# EAGLE design 01-main (EAGLE 9.6.2)

## Sheet 1 of 3
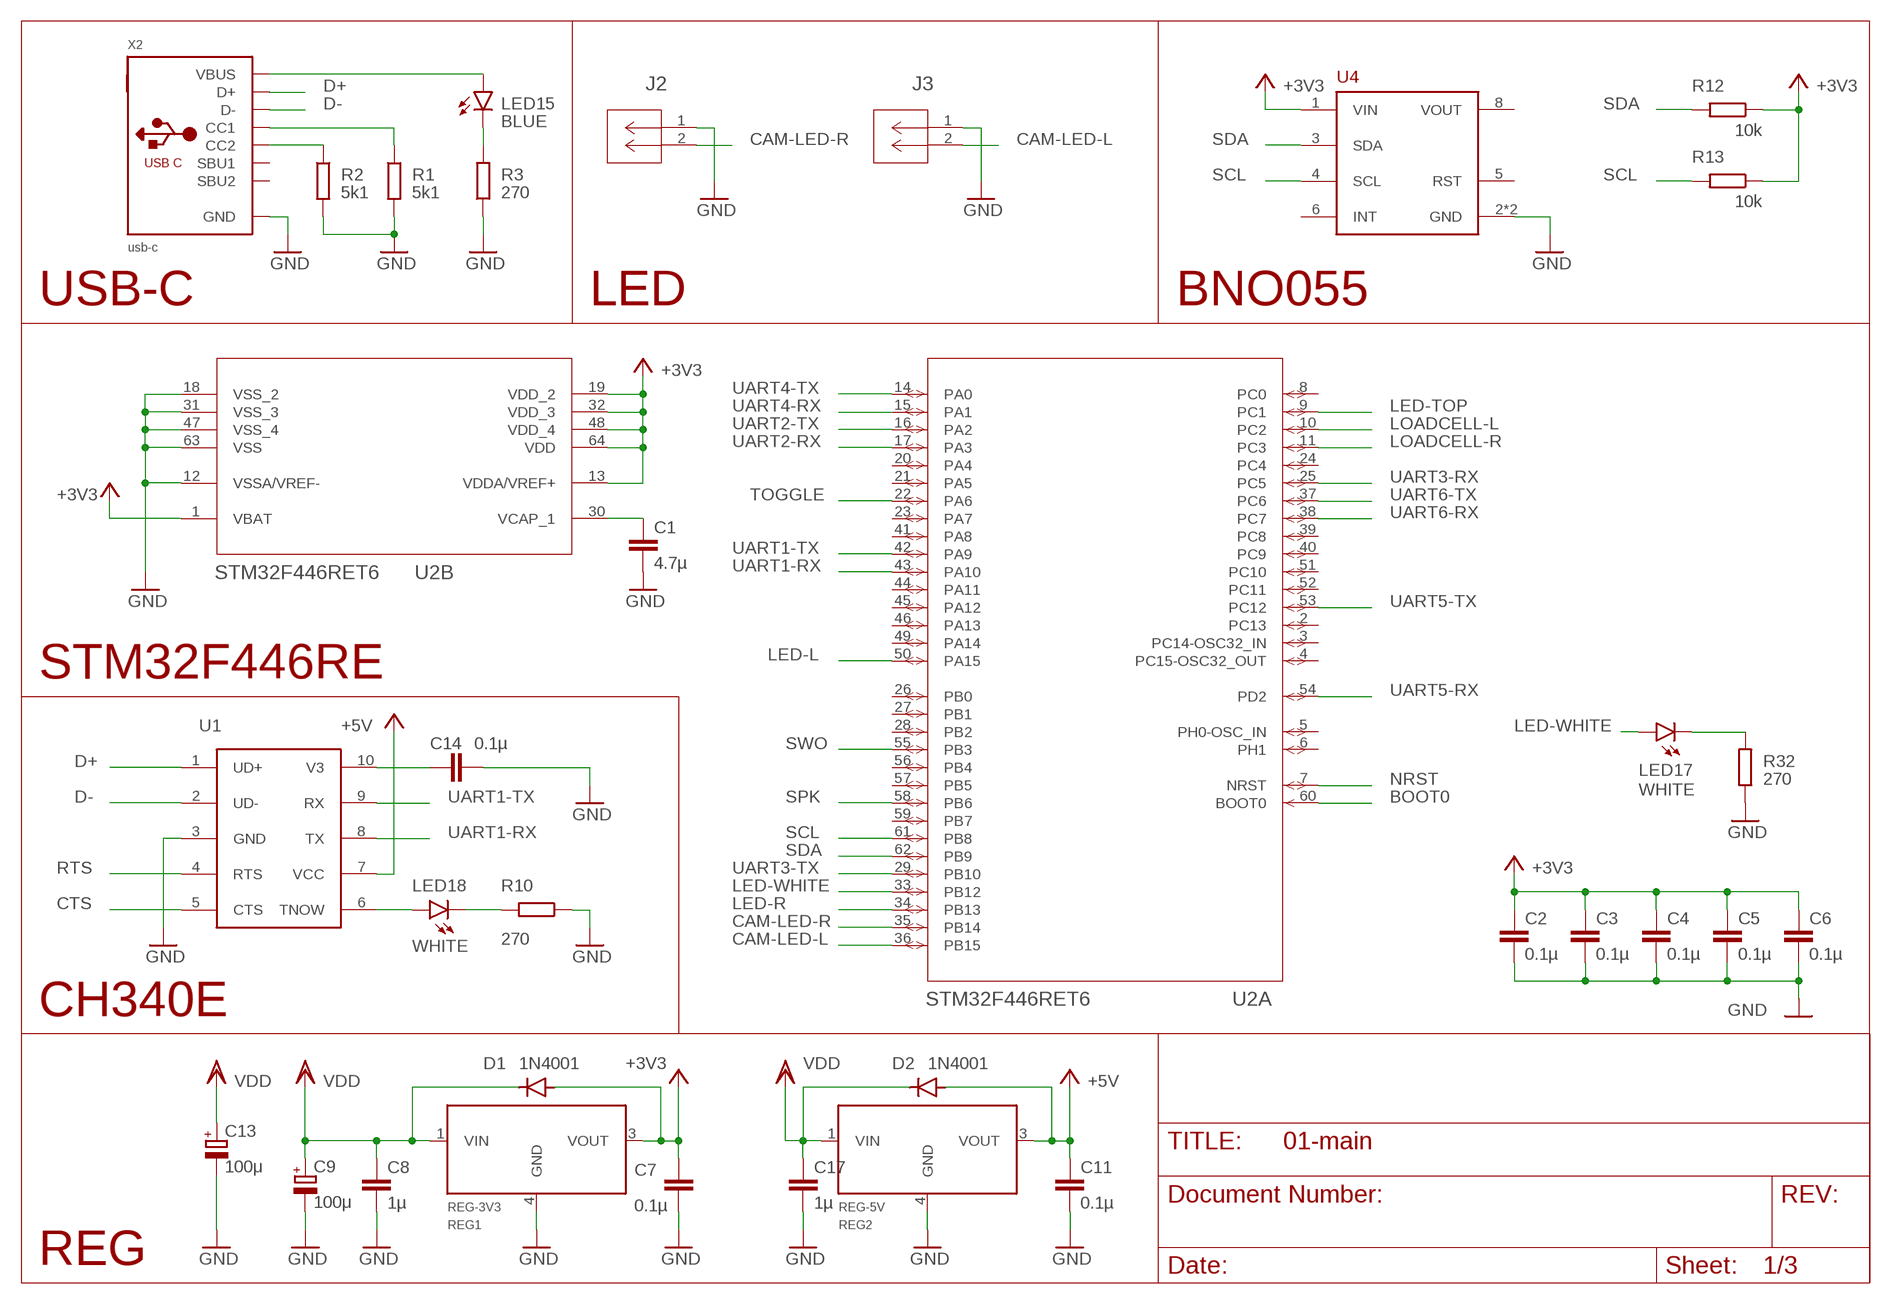
[diagram p0: schematic, sheet 1]

### Parts
C1  4.7µ  C-EUC0603  [C0603]
C2  0.1µ  C-EUC0603  [C0603]
C3  0.1µ  C-EUC0603  [C0603]
C4  0.1µ  C-EUC0603  [C0603]
C5  0.1µ  C-EUC0603  [C0603]
C6  0.1µ  C-EUC0603  [C0603]
C7  0.1µ  C-EUC0603  [C0603]
C8  1µ  C-EUC0603  [C0603]
C9  100μ  CPOL-EU153CLV-0505  [153CLV-0505]
C11  0.1µ  C-EUC0603  [C0603]
C13  100μ  CPOL-EU153CLV-0505  [153CLV-0505]
C14  0.1µ  C-EUC0603  [C0603]
C17  1µ  C-EUC0603  [C0603]
D1  1N4001  GF1  [SMA-DO214AC]
D2  1N4001  GF1  [SMA-DO214AC]
J2  22057025  [CON_22057025_MOL]
J3  22057025  [CON_22057025_MOL]
LED15  BLUE  LEDSML0603  [SML0603]
LED17  WHITE  LEDSML0603  [SML0603]
LED18  WHITE  LEDSML0603  [SML0603]
R1  5k1  R-EU_R0402  [R0402]
R2  5k1  R-EU_R0402  [R0402]
R3  270  R-EU_R0402  [R0402]
R10  270  R-EU_R0402  [R0402]
R12  10k  R-EU_R0402  [R0402]
R13  10k  R-EU_R0402  [R0402]
R32  270  R-EU_R0402  [R0402]
REG1  REG-3V3  MYPARTS_NJM7800S-REGULATOR  [MYPARTS_D-PAK_TO252AA]
REG2  REG-5V  MYPARTS_NJM7800S-REGULATOR  [MYPARTS_D-PAK_TO252AA]
U1  CH340ESMD  [MSOP10]
U2  STM32F446RET6  [LQFP64-10X10MM]
U4  BNO055  [SOCKET-08]
X2  usb-c  USB_C  [USB_C_CUSB31-CFM2AX-01-X]

### Nets
+3V3: C2.1 C3.1 C4.1 C5.1 C6.1 C7.1 D1.A R12.1 R13.1 REG1.3(VOUT) U2.1(B:VBAT) U2.13(B:VDDA/VREF+) U2.19(B:VDD_2) U2.32(B:VDD_3) U2.48(B:VDD_4) U2.64(B:VDD) U4.1(VIN) ; also sheet 3
+5V: C11.1 D2.A REG2.3(VOUT) U1.7(VCC) ; also sheet 2,3
BOOT0: U2.60(A:BOOT0) ; also sheet 3
CAM-LED-L: J3.2 U2.36(A:PB15)
CAM-LED-R: J2.2 U2.35(A:PB14)
CTS: U1.5(CTS)
D+: U1.1(UD+) X2.A6(D+) X2.B6(D+)
D-: U1.2(UD-) X2.A7(D-) X2.B7(D-)
GND: C1.2 C2.2 C3.2 C4.2 C5.2 C6.2 C7.2 C8.2 C9.- C11.2 C13.- C14.2 C17.2 J2.1 J3.1 R1.2 R2.2 R3.1 R10.1 R32.1 REG1.4(GND) REG2.4(GND) U1.3(GND) U2.12(B:VSSA/VREF-) U2.18(B:VSS_2) U2.31(B:VSS_3) U2.47(B:VSS_4) U2.63(B:VSS) U4.2(GND) U4.7(GND) X2.A1B12(GND) X2.B1A12(GND) ; also sheet 2,3
LED-L: U2.50(A:PA15) ; also sheet 2
LED-R: U2.34(A:PB13) ; also sheet 2
LED-TOP: U2.9(A:PC1) ; also sheet 2
LED-WHITE: LED17.A U2.33(A:PB12)
LOADCELL-L: U2.10(A:PC2) ; also sheet 3
LOADCELL-R: U2.11(A:PC3) ; also sheet 3
N$8: C14.1 U1.10(V3)
N$14: R1.1 X2.A5(CC1)
N$15: R2.1 X2.B5(CC2)
N$16: LED15.C R3.2
N$18: C1.1 U2.30(B:VCAP_1)
N$19: LED18.A U1.6(TNOW)
N$20: LED18.C R10.2
N$32: LED17.C R32.2
N$49: LED15.A X2.A4B9(VBUS) X2.B4A9(VBUS)
NRST: U2.7(A:NRST) ; also sheet 3
RTS: U1.4(RTS)
SCL: R13.2 U2.61(A:PB8) U4.4(SCL)
SDA: R12.2 U2.62(A:PB9) U4.3(SDA)
SPK: U2.58(A:PB6) ; also sheet 3
SWO: U2.55(A:PB3)
TOGGLE: U2.22(A:PA6) ; also sheet 3
UART1-RX: U1.8(TX) U2.43(A:PA10)
UART1-TX: U1.9(RX) U2.42(A:PA9) ; also sheet 3
UART2-RX: U2.17(A:PA3) ; also sheet 2
UART2-TX: U2.16(A:PA2) ; also sheet 2
UART3-RX: U2.25(A:PC5) ; also sheet 3
UART3-TX: U2.29(A:PB10) ; also sheet 3
UART4-RX: U2.15(A:PA1) ; also sheet 2
UART4-TX: U2.14(A:PA0) ; also sheet 2
UART5-RX: U2.54(A:PD2) ; also sheet 2
UART5-TX: U2.53(A:PC12) ; also sheet 2
UART6-RX: U2.38(A:PC7) ; also sheet 2
UART6-TX: U2.37(A:PC6) ; also sheet 2
VDD: C8.1 C9.+ C13.+ C17.1 D1.K(C) D2.K(C) REG1.1(VIN) REG2.1(VIN) ; also sheet 2,3
Unconnected: U2.2(A:PC13) U2.3(A:PC14-OSC32_IN) U2.4(A:PC15-OSC32_OUT) U2.5(A:PH0-OSC_IN) U2.6(A:PH1) U2.8(A:PC0) U2.20(A:PA4) U2.21(A:PA5) U2.23(A:PA7) U2.24(A:PC4) U2.26(A:PB0) U2.27(A:PB1) U2.28(A:PB2) U2.39(A:PC8) U2.40(A:PC9) U2.41(A:PA8) U2.44(A:PA11) U2.45(A:PA12) U2.46(A:PA13) U2.49(A:PA14) U2.51(A:PC10) U2.52(A:PC11) U2.56(A:PB4) U2.57(A:PB5) U2.59(A:PB7) U4.5(RST) U4.6(INT) X2.A8(SBU1) X2.B8(SBU2)

### Notes on the sheet
- USB-C | LED | BNO055
- STM32F446RE
- CH340E
- REG

## Sheet 2 of 3
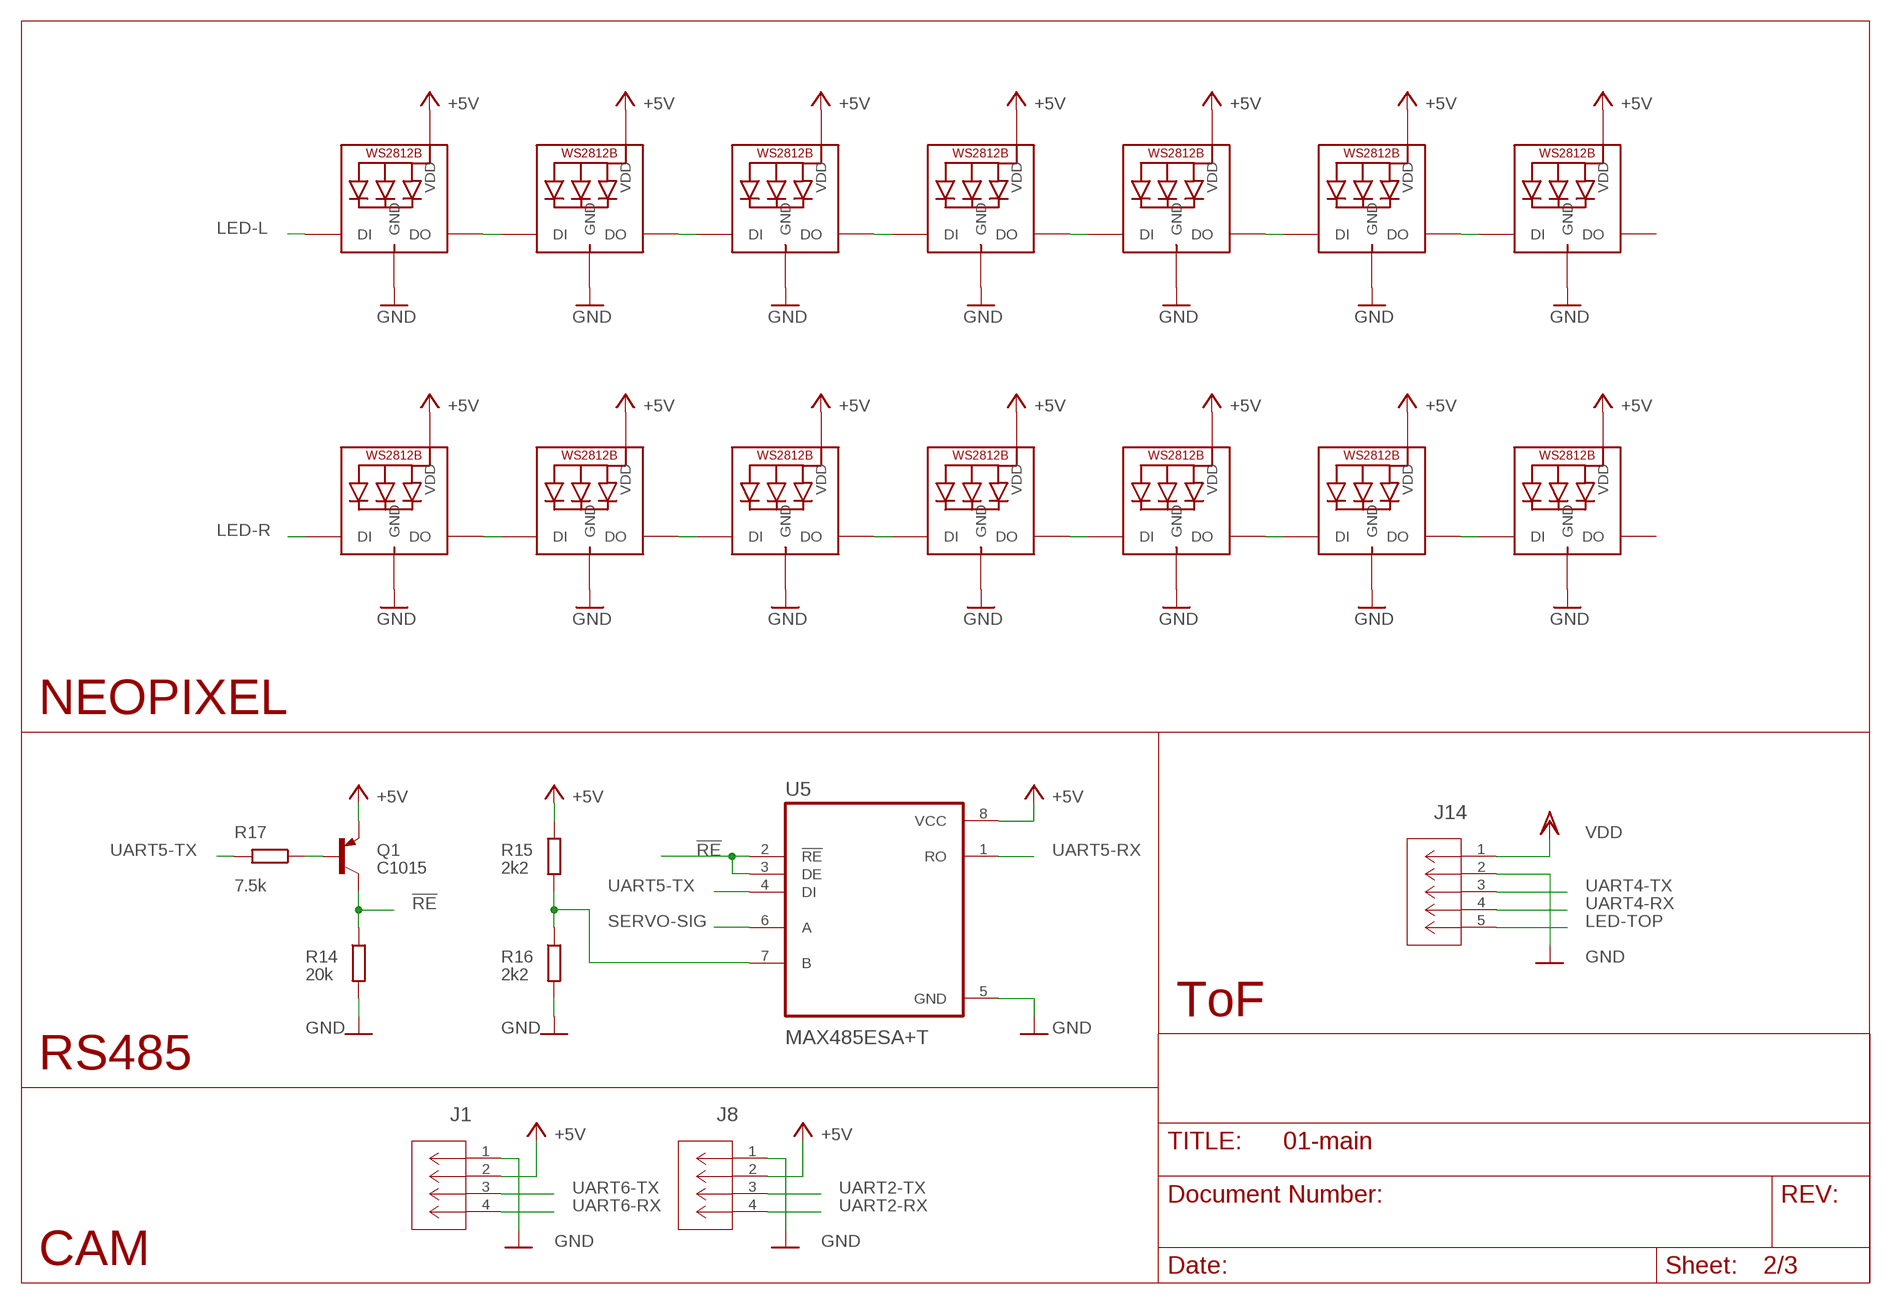
[diagram p1: schematic, sheet 2]

### Parts
J1  22057045  [CON_22057045_MOL]
J8  22057045  [CON_22057045_MOL]
J14  22057055  [CON_22057055_MOL]
LED1  WS2812B_2020  [WS2812B_2020]
LED2  WS2812B_2020  [WS2812B_2020]
LED3  WS2812B_2020  [WS2812B_2020]
LED4  WS2812B_2020  [WS2812B_2020]
LED5  WS2812B_2020  [WS2812B_2020]
LED6  WS2812B_2020  [WS2812B_2020]
LED7  WS2812B_2020  [WS2812B_2020]
LED8  WS2812B_2020  [WS2812B_2020]
LED9  WS2812B_2020  [WS2812B_2020]
LED10  WS2812B_2020  [WS2812B_2020]
LED11  WS2812B_2020  [WS2812B_2020]
LED12  WS2812B_2020  [WS2812B_2020]
LED13  WS2812B_2020  [WS2812B_2020]
LED14  WS2812B_2020  [WS2812B_2020]
Q1  C1015  BCX71SMD  [SOT23]
R14  20k  R-EU_R0402  [R0402]
R15  2k2  R-EU_R0402  [R0402]
R16  2k2  R-EU_R0402  [R0402]
R17  7.5k  R-EU_R0402  [R0402]
U5  MAX485ESA+T  [SOIC127P600X175-8N]

### Nets
!RE: Q1.3(C) R14.1 U5.2(!RE) U5.3(DE)
+5V: J1.2 J8.2 LED1.4(VDD) LED2.4(VDD) LED3.4(VDD) LED4.4(VDD) LED5.4(VDD) LED6.4(VDD) LED7.4(VDD) LED8.4(VDD) LED9.4(VDD) LED10.4(VDD) LED11.4(VDD) LED12.4(VDD) LED13.4(VDD) LED14.4(VDD) Q1.2(E) R15.1 U5.8(VCC) ; also sheet 1,3
GND: J1.1 J8.1 J14.2 LED1.2(GND) LED2.2(GND) LED3.2(GND) LED4.2(GND) LED5.2(GND) LED6.2(GND) LED7.2(GND) LED8.2(GND) LED9.2(GND) LED10.2(GND) LED11.2(GND) LED12.2(GND) LED13.2(GND) LED14.2(GND) R14.2 R16.2 U5.5(GND) ; also sheet 1,3
LED-L: LED1.3(DI) ; also sheet 1
LED-R: LED8.3(DI) ; also sheet 1
LED-TOP: J14.5 ; also sheet 1
N$1: LED1.1(DO) LED2.3(DI)
N$2: LED2.1(DO) LED3.3(DI)
N$3: LED3.1(DO) LED4.3(DI)
N$4: LED4.1(DO) LED5.3(DI)
N$5: LED5.1(DO) LED6.3(DI)
N$6: LED6.1(DO) LED7.3(DI)
N$7: LED8.1(DO) LED9.3(DI)
N$9: LED9.1(DO) LED10.3(DI)
N$10: LED10.1(DO) LED11.3(DI)
N$11: LED11.1(DO) LED12.3(DI)
N$12: LED12.1(DO) LED13.3(DI)
N$13: LED13.1(DO) LED14.3(DI)
N$27: Q1.1(B) R17.1
N$28: R15.2 R16.1 U5.7(B)
SERVO-SIG: U5.6(A) ; also sheet 3
UART2-RX: J8.4 ; also sheet 1
UART2-TX: J8.3 ; also sheet 1
UART4-RX: J14.4 ; also sheet 1
UART4-TX: J14.3 ; also sheet 1
UART5-RX: U5.1(RO) ; also sheet 1
UART5-TX: R17.2 U5.4(DI) ; also sheet 1
UART6-RX: J1.4 ; also sheet 1
UART6-TX: J1.3 ; also sheet 1
VDD: J14.1 ; also sheet 1,3
Unconnected: LED7.1(DO) LED14.1(DO)

### Notes on the sheet
- NEOPIXEL
- ToF
- RS485
- CAM

## Sheet 3 of 3
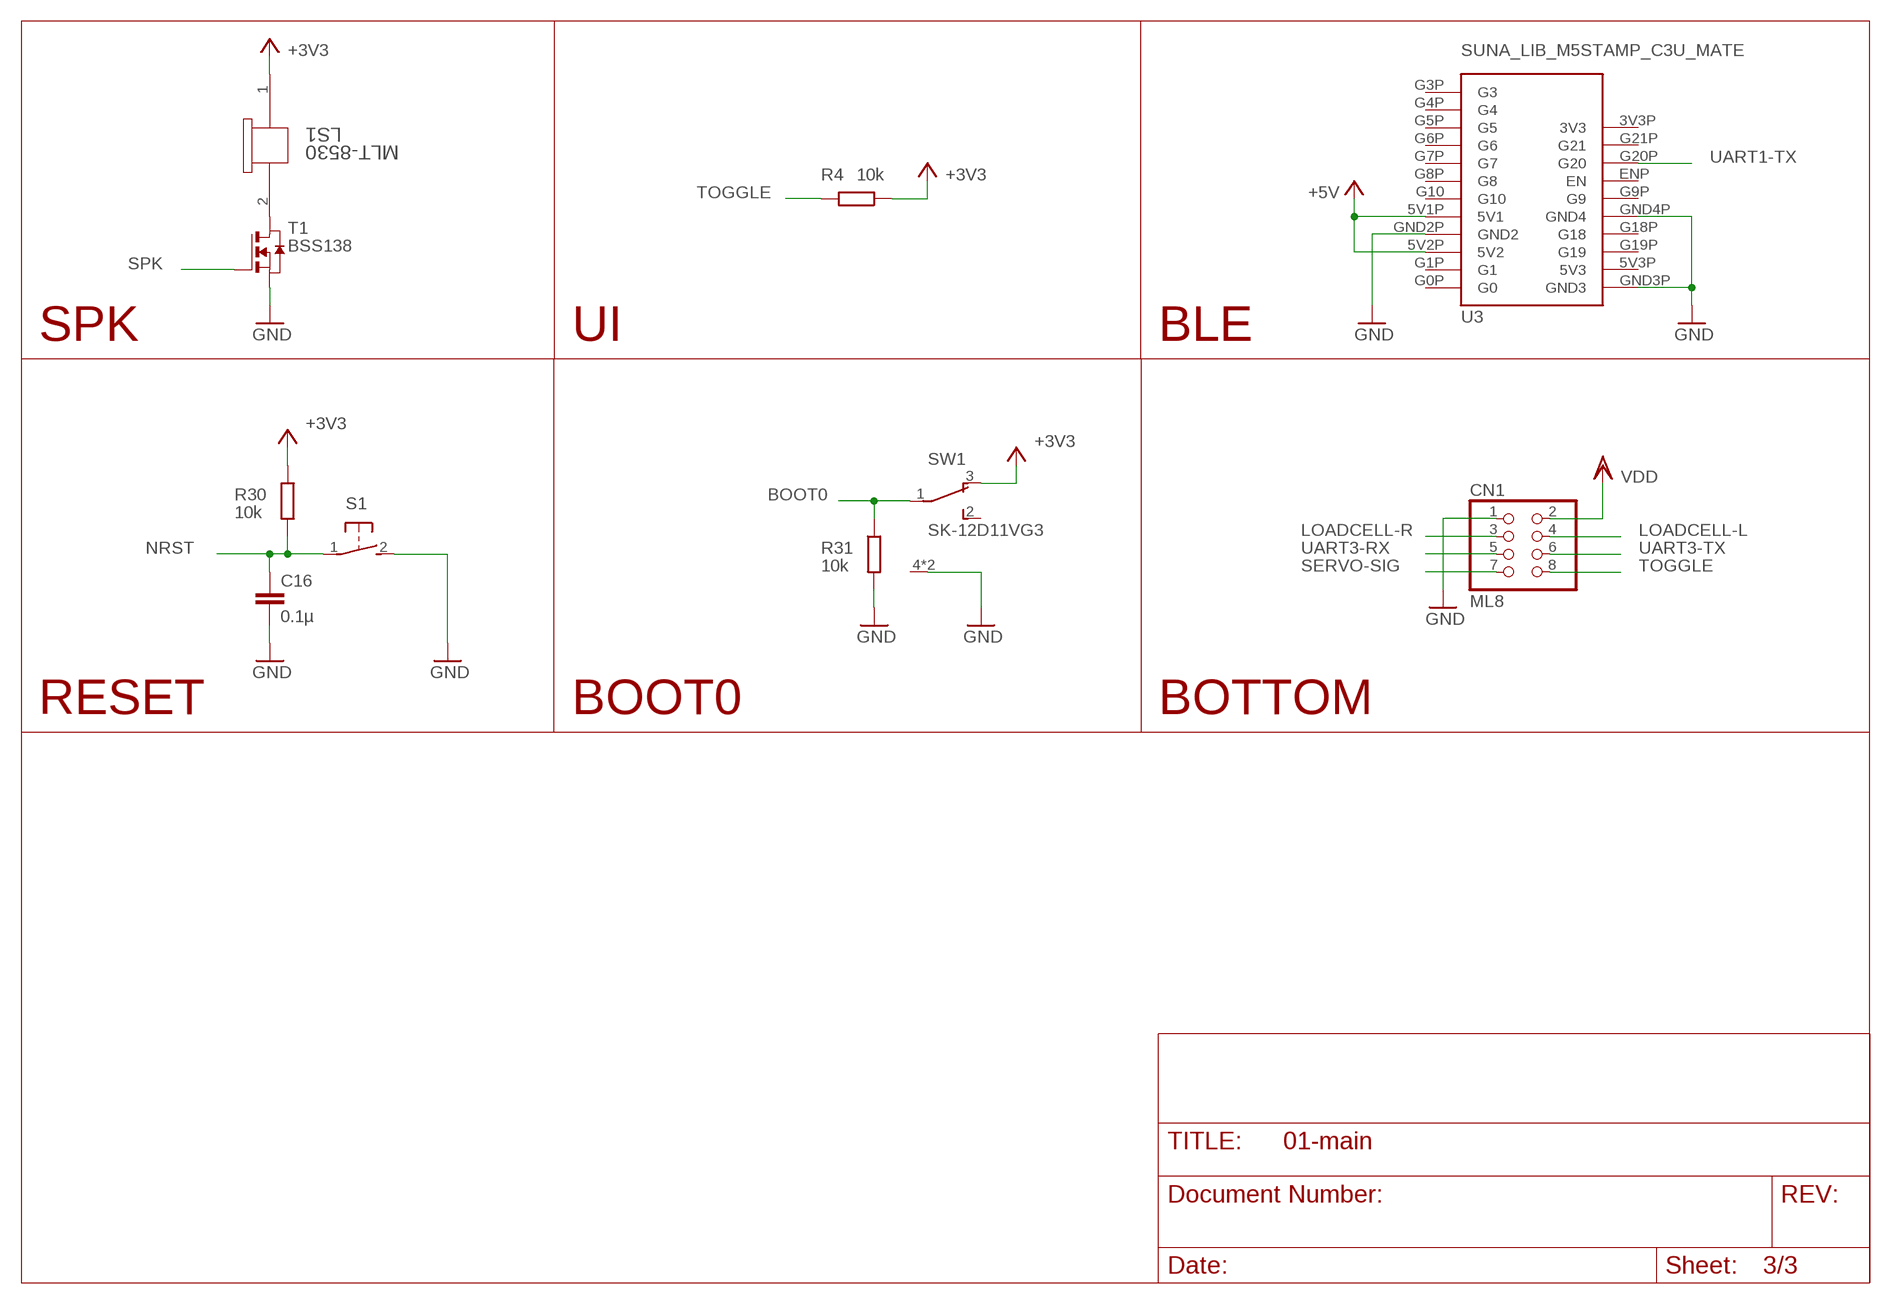
[diagram p2: schematic, sheet 3]

### Parts
C16  0.1µ  C-EUC0603  [C0603]
CN1  ML8  [ML6L]
LS1  MLT-8530  [MLT-8530_JHE]
R4  10k  R-EU_R0402  [R0402]
R30  10k  R-EU_R0402  [R0402]
R31  10k  R-EU_R0402  [R0402]
S1  31-XX  [B3F-31XX]
SW1  SK-12D11VG3  [SK-12D11VG3]
T1  BSS138  NMOSSOT23  [SOT-23]
U3  SUNA_LIB_M5STAMP_C3U_MATE  [SUNA_LIB_M5STAMPC3UMATE]

### Nets
+3V3: LS1.1 R4.1 R30.1 SW1.3(O) ; also sheet 1
+5V: U3.5V1P(5V1) U3.5V2P(5V2) ; also sheet 1,2
BOOT0: R31.1 SW1.1(P) ; also sheet 1
GND: C16.2 CN1.1 R31.2 S1.2(S) SW1.4(CASE) SW1.5(CASE) T1.2(S) U3.GND2P(GND2) U3.GND3P(GND3) U3.GND4P(GND4) ; also sheet 1,2
LOADCELL-L: CN1.4 ; also sheet 1
LOADCELL-R: CN1.3 ; also sheet 1
N$17: LS1.2 T1.1(D)
NRST: C16.1 R30.2 S1.1(P) ; also sheet 1
SERVO-SIG: CN1.7 ; also sheet 2
SPK: T1.3(G) ; also sheet 1
TOGGLE: CN1.8 R4.2 ; also sheet 1
UART1-TX: U3.G20P(G20) ; also sheet 1
UART3-RX: CN1.5 ; also sheet 1
UART3-TX: CN1.6 ; also sheet 1
VDD: CN1.2 ; also sheet 1,2
Unconnected: SW1.2(S) U3.3V3P(3V3) U3.5V3P(5V3) U3.ENP(EN) U3.G0P(G0) U3.G1P(G1) U3.G3P(G3) U3.G4P(G4) U3.G5P(G5) U3.G6P(G6) U3.G7P(G7) U3.G8P(G8) U3.G9P(G9) U3.G10 U3.G18P(G18) U3.G19P(G19) U3.G21P(G21)

### Notes on the sheet
- SPK | UI | BLE
- RESET | BOOT0 | BOTTOM

## Power pins joined to a net without a drawn wire
VOUT: U4.8(VOUT)

## Library data of the parts
C1-C8 C11 C14 C16 C17 = rcl:C-EU: CAPACITOR, European symbol; SPICEPREFIX: C
C9 C13 = rcl:CPOL-EU: POLARIZED CAPACITOR, European symbol; SPICEPREFIX: C
CN1 = ML8:ML8
D1 D2 = diode:GF1: DIODE
J1 J8 = con-molex-5268:22057045; COPYRIGHT: Copyright (C) 2022 Ultra Librarian. All rights reserved.; MANUFACTURER_PART_NUMBER: 22057045; MFR_NAME: Molex Connector Corporation
J2 J3 = con-molex-5268:22057025; COPYRIGHT: Copyright (C) 2022 Ultra Librarian. All rights reserved.; MANUFACTURER_PART_NUMBER: 22057025; MFR_NAME: Molex Connector Corporation
J14 = con-molex-5268:22057055; COPYRIGHT: Copyright (C) 2022 Ultra Librarian. All rights reserved.; MANUFACTURER_PART_NUMBER: 22057055; MFR_NAME: Molex Connector Corporation
LED1-LED14 = microbuilder:WS2812B
LED15 LED17 LED18 = led:LED: LED OSRAM: - CHIPLED LG R971, LG N971, LY N971, LG Q971, LY Q971, LO R971, LY R971 LH N974, LH R974 LS Q976, LO Q976, LY Q976 LO Q996 - Hyper CHIPLED LW Q18S LB Q993, LB Q99A, LB R99A - SideLED LS A670, LO A670, LY A670, LG A670, LP A670 LB A673, LV A673, LT A673, LW A673 LH A674 LY A675 LS A676, LA A676, LO A676, LY A676, LW A676 LS A679, LY A679, LG A679 - Hyper Micro SIDELED® LS Y876, LA Y876, LO Y876, LY Y876 LT Y87S - SmartLED LW L88C, LW L88S LB L89C, LB L89S, LG L890 LS L89K, LO L89K, LY L89K LS L896, LA L896, LO L896, LY L896 - TOPLED LS T670, LO T670, LY T670, LG T670, LP T670 LSG T670, LSP T670, LSY T670, LOP T670, LYG T670 LG T671, LOG T671, LSG T671 LB T673, LV T673, LT T673, LW T673 LH T674 LS T676, LA T676, LO T676, LY T676, LB T676, LH T676, LSB T676, LW T676 LB T67C, LV T67C, LT T67C, LS T67K, LO T67K, LY T67K, LW E67C LS E67B, LA E67B, LO E67B, LY E67B, LB E67C, LV E67C, LT E67C LW T67C LS T679, LY T679, LG T679 LS T770, LO T770, LY T770, LG T770, LP T770 LB T773, LV T773, LT T773, LW T773 LH T774 LS E675, LA E675, LY E675, LS T675 LS T776, LA T776, LO T776, LY T776, LB T776 LHGB T686 LT T68C, LB T68C - Hyper Mini TOPLED® LB M676 - Mini TOPLED Santana® LG M470 LS M47K, LO M47K, LY M47K Source: http://www.osram.convergy.de LUXEON: - LUMILED® LXK2-PW12-R00, LXK2-PW12-S00, LXK2-PW14-U00, LXK2-PW14-V00 LXK2-PM12-R00, LXK2-PM12-S00, LXK2-PM14-U00 LXK2-PE12-Q00, LXK2-PE12-R00, LXK2-PE12-S00, LXK2-PE14-T00, LXK2-PE14-U00 LXK2-PB12-K00, LXK2-PB12-L00, LXK2-PB12-M00, LXK2-PB14-N00, LXK2-PB14-P00, LXK2-PB14-Q00 LXK2-PR12-L00, LXK2-PR12-M00, LXK2-PR14-Q00, LXK2-PR14-R00 LXK2-PD12-Q00, LXK2-PD12-R00, LXK2-PD12-S00 LXK2-PH12-R00, LXK2-PH12-S00 LXK2-PL12-P00, LXK2-PL12-Q00, LXK2-PL12-R00 Source: www.luxeon.com KINGBRIGHT: KA-3528ASYC Source: www.kingbright.com
LS1 = MLT-8530:MLT-8530; COPYRIGHT: Copyright (C) 2022 Ultra Librarian. All rights reserved.; MANUFACTURER_PART_NUMBER: MLT-8530; MFR_NAME: Jiangsu Huaneng Elec
Q1 = transistor-pnp:BCX71SMD: PNP Transistor
R1-R4 R10 R12-R17 R30-R32 = rcl:R-EU_: RESISTOR, European symbol; SPICEPREFIX: R
REG1 REG2 = #001-line:MYPARTS_NJM7800S-REGULATOR
S1 = switch-omron:31-XX: OMRON SWITCH; MPN: B3F-3100; OC_FARNELL: 959704; OC_NEWARK: 36M3582
SW1 = Slide Switch:SK-12D11VG3
T1 = zetex:NMOSSOT23: MOS FET; OC_FARNELL: unknown; OC_NEWARK: unknown
U1 = CH340E:CH340E: WCH.CN/CH340E See DataSheet： wch.cn <http://www.wch.cn/downloads/CH340DS1_PDF.html>
U2 = F446RE:STM32F446RET6; COPYRIGHT: Copyright (C) 2022 Ultra Librarian. All rights reserved.; MANUFACTURER_PART_NUMBER: STM32F446RET6; MFR_NAME: STMicroelectronics
U3 = M5StampC3-pin:SUNA_LIB_M5STAMP_C3U_MATE
U4 = BNO055:BNO055
U5 = MAX485:MAX485ESA+T: Check availability <https://pricing.snapeda.com/parts/MAX485ESA/Maxim%20Integrated/view-part?ref=eda>; AVAILABILITY: In Stock; DESCRIPTION: 1/1 Transceiver Half RS422, RS485 8-SOIC; MF: Maxim Integrated; MP: MAX485ESA; PACKAGE: SOIC-8 Maxim; PRICE: None; PURCHASE-URL: https://pricing.snapeda.com/search/part/MAX485ESA/?ref=eda
X2 = microbuilder:USB_C: USB Type-C USB 2.0 Connector

## Net classes
0 default: width 0.254 mm

## Board
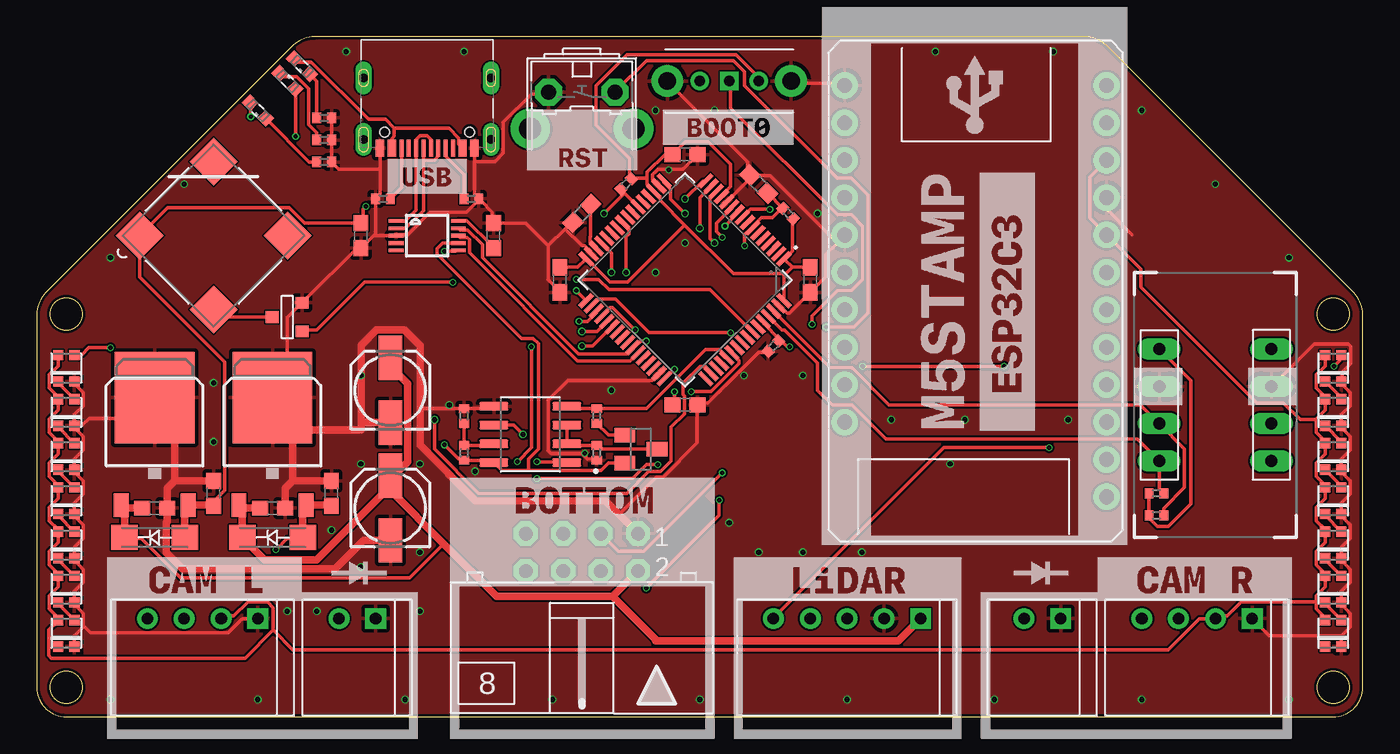
[diagram p3: board, top side]
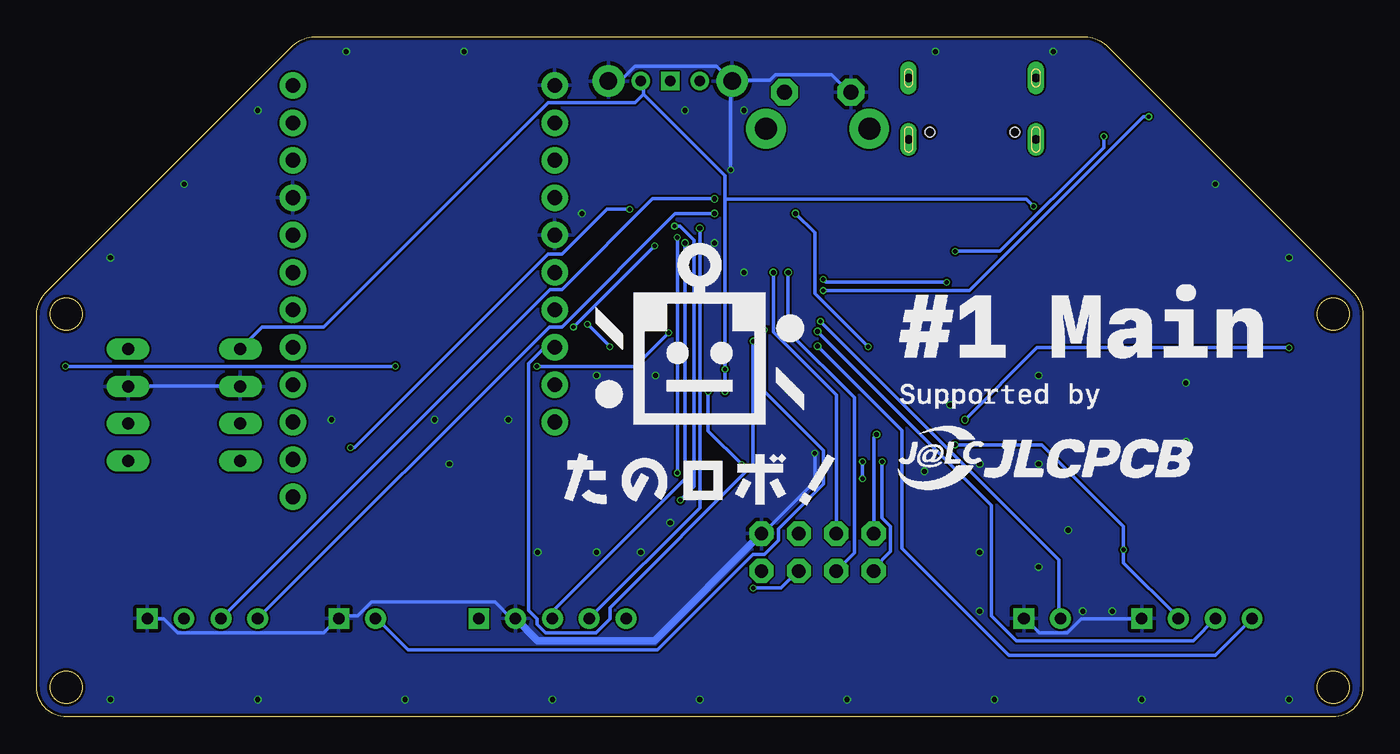
[diagram p4: board, bottom side, seen from below]

Size 90 x 46.17 mm. Coordinates in mm from the lower left corner, seen from the top.
Outline: 2,0 88,0 arc90 90,2 90,27.34 arc45 89.41,28.76 72.59,45.59 arc45 71.17,46.17 18.83,46.17 arc45 17.41,45.59 0.59,28.76 arc45 0,27.34 0,2 arc90 2,0
Outline: circle at 88,2 radius 1.1
Outline: circle at 2,27.34 radius 1.1
Outline: circle at 2,2 radius 1.1
Outline: circle at 88,27.34 radius 1.1
Copper layers (1*16): Top 0.035mm / dielectric 1.6mm / Bottom 0.035mm
Design rules "jlcpcb-2layers *": minimum track width 5mil, minimum drill 0.3mm, track to track 5mil, track to pad 5mil, pad to pad 5mil, via to via 5mil, smd to smd 5mil, copper to edge 0.2mm, drill to drill 6mil, minimum pad ring 10mil, minimum via ring 3mil, stop-mask expansion 4mil, vias tented up to drill 20mil, thermal gap 10mil
tRestrict: area 42,24.2 to 45,25.2; 1 lines

### Footprints (pad centres in the part's own frame; a part is rotated, then mirrored left to right if it is on the bottom)
C0603 = smd 1.1 x 1: 1 -0.85,0; 2 0.85,0
153CLV-0505 = smd 3 x 1.6: + 2.2,0; - -2.2,0
ML6L = drill 0.914 octagon: 1 -3.81,-1.27; 2 -3.81,1.27; 3 -1.27,-1.27; 4 -1.27,1.27; 5 1.27,-1.27; 6 1.27,1.27; 7 3.81,-1.27; 8 3.81,1.27
SMA-DO214AC = smd 1.8 x 1.7: A -2.05,0; K 2.05,0
CON_22057045_MOL = drill 0.787 pad 1.143 square: 1 0,0 | drill 0.787 pad 1.143: 2 -2.489,0; 3 -5.004,0; 4 -7.493,0
CON_22057025_MOL = drill 0.787 pad 1.143 square: 1 0,0 | drill 0.787 pad 1.143: 2 -2.489,0
CON_22057055_MOL = drill 0.787 pad 1.143 square: 1 0,0 | drill 0.787 pad 1.143: 2 -2.489,0; 3 -5.004,0; 4 -7.493,0; 5 -10.008,0
WS2812B_2020 = smd 0.7 x 0.7: 1 0.9,-0.55; 2 0.9,0.55; 3 -0.9,0.55; 4 -0.9,-0.55
SML0603 = smd 0.8 x 0.8: A 0.75,0; C -0.75,0
MLT-8530_JHE = smd 2.311 x 2.311: 1 -3.55,3.55; 2 -3.55,-3.55; 3 3.55,3.55; 4 3.55,-3.55
SOT23 = smd 1 x 1.4: 1 -0.95,-1.1; 2 0.95,-1.1; 3 0,1.1
R0402 = smd 0.6 x 0.7: 1 -0.5,0; 2 0.5,0
MYPARTS_D-PAK_TO252AA = smd 1 x 1.6: 1 -2.28,-4.8; 3 2.28,-4.8 | smd 5.4 x 6.2: 4 0,2.5
B3F-31XX = drill 1.016 octagon: 1 -2.261,-1.245; 2 2.261,-1.245 | drill 1.499 pad 2.159: 3 -3.505,1.245; 4 3.505,1.245
SK-12D11VG3 = drill 0.7 square: 1 0,0 | drill 0.7: 2 -2,0; 3 2,0 | drill 1.2: 4 -4.2,0; 5 4.2,0
SOT-23 = smd 0.787 x 0.889: 1 0.025,-1.016; 2 -0.94,1.016; 3 0.991,1.016
MSOP10 = smd 1 x 0.25: 1 -2.113,1; 2 -2.113,0.5; 3 -2.113,0; 4 -2.113,-0.5; 5 -2.113,-1; 6 2.113,-1; 7 2.113,-0.5; 8 2.113,0; 9 2.113,0.5; 10 2.113,1
LQFP64-10X10MM = smd 1.194 x 0.305: 1 -5.75,3.75; 2 -5.75,3.25; 3 -5.75,2.75; 4 -5.75,2.25; 5 -5.75,1.75; 6 -5.75,1.25; 7 -5.75,0.75; 8 -5.75,0.25; 9 -5.75,-0.25; 10 -5.75,-0.75; 11 -5.75,-1.25; 12 -5.75,-1.75; 13 -5.75,-2.25; 14 -5.75,-2.75; 15 -5.75,-3.25; 16 -5.75,-3.75; 33 5.75,-3.75; 34 5.75,-3.25; 35 5.75,-2.75; 36 5.75,-2.25; 37 5.75,-1.75; 38 5.75,-1.25; 39 5.75,-0.75; 40 5.75,-0.25; 41 5.75,0.25; 42 5.75,0.75; 43 5.75,1.25; 44 5.75,1.75; 45 5.75,2.25; 46 5.75,2.75; 47 5.75,3.25; 48 5.75,3.75 | smd 0.305 x 1.194: 17 -3.75,-5.75; 18 -3.25,-5.75; 19 -2.75,-5.75; 20 -2.25,-5.75; 21 -1.75,-5.75; 22 -1.25,-5.75; 23 -0.75,-5.75; 24 -0.25,-5.75; 25 0.25,-5.75; 26 0.75,-5.75; 27 1.25,-5.75; 28 1.75,-5.75; 29 2.25,-5.75; 30 2.75,-5.75; 31 3.25,-5.75; 32 3.75,-5.75; 49 3.75,5.75; 50 3.25,5.75; 51 2.75,5.75; 52 2.25,5.75; 53 1.75,5.75; 54 1.25,5.75; 55 0.75,5.75; 56 0.25,5.75; 57 -0.25,5.75; 58 -0.75,5.75; 59 -1.25,5.75; 60 -1.75,5.75; 61 -2.25,5.75; 62 -2.75,5.75; 63 -3.25,5.75; 64 -3.75,5.75
SUNA_LIB_M5STAMPC3UMATE = drill 1: 3V3P 10.16,10.16; 5V1P -7.62,-2.54; 5V2P -7.62,-7.62; 5V3P 10.16,-10.16; ENP 10.16,2.54; G0P -7.62,-12.7; G1P -7.62,-10.16; G3P -7.62,15.24; G4P -7.62,12.7; G5P -7.62,10.16; G6P -7.62,7.62; G7P -7.62,5.08; G8P -7.62,2.54; G9P 10.16,0; G10 -7.62,0; G18P 10.16,-5.08; G19P 10.16,-7.62; G20P 10.16,5.08; G21P 10.16,7.62; GND2P -7.62,-5.08; GND3P 10.16,-12.7; GND4P 10.16,-2.54
SOCKET-08 = drill 0.813 long: 1 -3.81,-3.81; 2 -1.27,-3.81; 3 1.27,-3.81; 4 3.81,-3.81; 5 3.81,3.81; 6 1.27,3.81; 7 -1.27,3.81; 8 -3.81,3.81
SOIC127P600X175-8N = smd 1.97 x 0.59: 1 -2.475,1.905; 2 -2.475,0.635; 3 -2.475,-0.635; 4 -2.475,-1.905; 5 2.475,-1.905; 6 2.475,-0.635; 7 2.475,0.635; 8 2.475,1.905
USB_C_CUSB31-CFM2AX-01-X = smd 0.575 x 1.15: A1B12 -3.2,3.545; A4B9 -2.4,3.545; B1A12 3.2,3.545; B4A9 2.4,3.545 | smd 0.275 x 1.15: A5 -1.25,3.545; A6 -0.25,3.545; A7 0.25,3.545; A8 1.25,3.545; B5 1.75,3.545; B6 0.75,3.545; B7 -0.75,3.545; B8 -1.75,3.545 | drill 0.6 pad 1 long: M1 -4.32,2.97; M2 4.32,2.97; M3 -4.32,-1.21; M4 4.32,-1.21 | hole 0.65: 2.89,2.47; -2.89,2.47

### Placement (x,y rotation side)
C1  37,34.17 225 top
C2  52.5,29.67 270 top
C3  44,38.17 0 top
C4  44,21.17 0 top
C5  35.5,29.67 270 top
C6  22,32.67 270 top
C7  12,15.17 90 top
C8  16,14.17 0 top
C9  24,14.17 90 top
C11  20,15.17 90 top
C13  24,22.17 90 top
C14  31,32.67 90 top
C16  49,36.17 135 top
C17  8,14.17 0 top
CN1  37,11.17 180 top
D1  8,12.17 180 top
D2  16,12.17 180 top
J1  15,6.67 0 top
J2  23,6.67 0 top
J3  69.5,6.67 0 top
J8  82.5,6.67 0 top
J14  60,6.67 0 top
LED1  2,23.67 270 top
LED2  2,20.67 270 top
LED3  2,17.67 270 top
LED4  2,14.67 270 top
LED5  2,11.67 270 top
LED6  2,8.67 270 top
LED7  2,5.67 270 top
LED8  88,23.67 270 top
LED9  88,20.67 270 top
LED10  88,17.67 270 top
LED11  88,14.67 270 top
LED12  88,11.67 270 top
LED13  88,8.67 270 top
LED14  88,5.67 270 top
LED15  18,44.17 135 top
LED17  15,41.17 135 top
LED18  17,43.17 315 top
LS1  12,32.67 45 top
Q1  41,18.17 270 top
R1  29.5,35.17 0 top
R2  23.5,35.17 180 top
R3  19.5,40.67 180 top
R4  40,36.17 225 top
R10  19.5,39.17 180 top
R12  76,13.67 0 top
R13  76,15.17 0 top
R14  38,17.92 270 top
R15  29,17.92 90 top
R16  29,20.42 90 top
R17  38,20.42 90 top
R30  51,34.17 135 top
R31  50,25.17 225 top
R32  19.5,37.67 180 top
REG1  8,19.17 0 top
REG2  16,19.17 0 top
S1  37,41.17 180 top
SW1  47,43.17 0 top
T1  17,27.17 270 top
U1  26.5,32.67 0 top
U2  44,29.67 225 top
U3  65,30.17 180 top
U4  80,21.17 270 top
U5  33.5,19.17 180 top
X2  26.5,42.17 180 top

### Tracks (layer width: path | path; a pad name or v marks a point on that pad's centre or on a via)
!RE
  Top 0.254: U5.3 U5.2 36.09,18.42 R14.1 38.25,18.17 Q1.3
+3V3  (via drill 0.3)
  Top 0.254: 11.95,14.37 11.95,14.56 12.75,15.37 12.75,24.08 6.98,29.85 LS1.1 8.87,34.56 17.13,34.56 18.16,33.52 C6.1 22.14,33.7 22.14,34.46 v22.33,34.65 | C2.1 51.28,30.52 | 51.28,30.52 U2.1 50.91,31.23 51.29,31.61 51.29,33.7 R30.1 | U2.64 50.72,29.96 | 50.72,29.96 51.28,30.52 | C5.1 36.72,30.52 U2.32 37.38,31.04 38.9,29.51 40.09,29.51 43.98,33.39 | 41.42,36.56 41.42,36.97 42.63,38.17 C3.1 43.29,38.27 44.05,39.04 45.57,39.04 47.09,37.51 47.09,35.99 46.52,35.42 U2.13 | 41.42,36.56 41.42,36.14 U2.19 41.95,35.61 42.33,35.23 42.33,35.04 43.98,33.39 | R13.1 R12.1 75.67,13.51 75.67,13.32 76.05,12.94 76.81,12.94 78.34,14.46 78.34,22.84 76.24,24.94 U4.1 | 41.42,36.56 40.43,36.56 R4.1 40.24,36.56 40.24,37.89 37.95,40.18 37.95,42.85 40.05,44.94 47.48,44.94 48.81,43.61 48.81,43.23 SW1.3 | 43.98,33.39 47.29,30.08 50.72,30.08 50.72,29.96 | v43.29,22.08 43.29,21.32 C4.1 | v43.29,23.61 42.71,23.03 U2.48
  Top 0.508: D1.A 10.05,14.14 REG1.3 11.95,14.37 C7.1
  Bottom 0.254: 43.29,35.15 43.29,36.75 48.81,42.27 | v43.29,22.08 v43.29,23.61 43.29,35.15 | 48.81,42.27 48.81,43.04 SW1.3 | 48.81,42.27 49.38,41.7 55.29,41.7 70.53,26.46 74.71,26.46 U4.1 | 43.29,35.15 22.83,35.15 v22.33,34.65
+5V  (via drill 0.3)
  Top 0.254: LED8.4 87.45,23.83 86.85,23.23 86.85,22.32 87.45,21.71 LED9.4 87.45,20.83 86.85,20.23 86.85,20.18 | 86.85,20.18 86.85,19.32 87.45,18.71 LED10.4 87.45,17.83 86.85,17.23 86.85,16.32 87.45,15.71 LED11.4 87.45,14.83 86.85,14.23 86.85,13.32 87.45,12.71 LED12.4 87.45,11.83 86.85,11.23 86.85,10.32 87.45,9.71 LED13.4 87.45,8.83 86.85,8.23 86.85,7.79 | 86.85,7.79 86.85,7.32 87.45,6.71 LED14.4 | LED1.4 1.45,23.83 0.85,23.23 0.85,22.32 1.45,21.71 LED2.4 1.45,20.83 0.85,20.23 0.85,19.32 1.45,18.71 LED3.4 1.45,17.83 0.85,17.23 0.85,16.32 1.45,15.71 LED4.4 1.45,14.83 0.85,14.23 0.85,13.32 1.45,12.71 LED5.4 1.45,11.83 0.85,11.23 0.85,10.32 1.45,9.71 LED6.4 1.45,8.83 0.85,8.23 0.85,7.32 1.45,6.71 LED7.4 1.38,6.46 0.8,5.89 0.8,4.17 0.99,3.98 14.14,3.98 16.04,5.89 | Q1.2 38.81,17.22 38.3,16.72 33.38,16.72 | 33.38,16.72 31.57,16.72 U5.8 30.87,17.42 R15.1 29,17.51 28.62,17.51 v27.66,18.46 | 86.85,7.79 81.77,7.79 80.81,6.84 80.05,6.84 J8.2 79.86,6.65 78.91,6.65 76.81,4.56 17.38,4.56 16.04,5.89 | 86.85,20.18 85.77,20.18 84.62,21.32 82.81,21.32 74.93,29.19 74.93,30.4 U3.5V1P 71.47,33.87 71.47,36.64 U3.5V2P | 33.38,16.72 33.38,17.51 34.05,18.18 34.05,25.33 33.68,25.7 32.89,25.7 27.18,31.41 27.18,31.81 27.56,32.18 28.43,32.18 U1.7 | 16.04,5.89 16.04,7.41 15.66,7.79 14.33,7.79 13.38,6.84 12.62,6.84 J1.2 | v16.23,11.34 17,12.1 17.95,12.1 D2.A
  Top 0.508: C11.1 19.95,14.37 REG2.3 18.05,14.14 D2.A
  Bottom 0.254: J1.2 12.62,6.84 16.23,10.46 v16.23,11.34 16.23,12.94 21.76,18.46 v27.66,18.46
BOOT0  (via drill 0.3)
  Top 0.254: U2.60 49.38,26.65 50.33,25.7 R31.1 50.52,25.51 50.91,25.13 v51.1,25.13 | v52.62,26.65 52.62,27.23 54.34,28.94 55.29,28.94 56.05,29.7 56.05,33.32 55.29,34.08 54.34,34.08 47.09,41.32 47.09,43.04 SW1.1
  Bottom 0.254: v52.62,26.65 v51.1,25.13
CAM-LED-L  (via drill 0.3)
  Top 0.254: v40.62,26.27 39.09,27.8 38.9,27.8 38.33,27.23 U2.36
  Bottom 0.254: v40.62,26.27 40.62,22.08 36.62,18.08 36.62,15.8 39.67,12.75 39.67,11.99 40.62,11.03 41.38,11.03 47.86,4.56 64.81,4.56 66.91,6.65 J3.2
CAM-LED-R  (via drill 0.3)
  Top 0.254: v36.81,26.84 37.38,26.84 37.95,27.42 U2.35
  Bottom 0.254: v36.81,26.84 20.62,10.65 20.62,6.84 J2.2
D+
  Top 0.254: U1.1 25,33.67 25.75,34.42 X2.B6 25.75,39.2 26.01,39.46 26.49,39.46 26.75,39.2 X2.A6
D-
  Top 0.254: U1.2 25.04,33.17 26.25,34.38 26.25,37.8 | X2.B7 27.25,38.05 26.99,37.8 26.25,37.8 | X2.A7 26.25,37.8
GND  (via drill 0.3, 0.35)
  Top 0.254: X2.A1B12 29.7,37.7 | 29.7,37.7 29.7,35.47 R1.2 | X2.B1A12 23.3,37.17 | 23.3,37.17 23.3,35.47 R2.2 23,32.67 | R10.1 R32.1 20.5,37.17 23.3,37.17 | R10.1 20,39.23 | 20,39.23 R3.1 | C6.2 22.18,32 | 22.18,32 22.85,32.67 23,32.67 | 23,32.67 U1.3 24.43,32.75 25.19,32.75 26.71,34.27 29.19,34.27 29.95,35.04 R1.2 | LED14.2 88.55,5.51 | 88.55,5.51 89.15,6.12 89.15,7.03 88.55,7.63 LED13.2 88.55,8.51 89.15,9.12 89.15,10.03 88.55,10.63 LED12.2 88.55,11.51 89.15,12.12 89.15,13.03 88.55,13.63 LED11.2 88.55,14.51 89.15,15.12 89.15,16.03 88.55,16.63 LED10.2 88.55,17.51 89.15,18.12 89.15,19.03 88.55,19.63 LED9.2 88.55,20.51 89.15,21.12 89.15,22.03 88.55,22.63 LED8.2 88.62,22.84 88.62,23.42 89.2,23.99 89.2,25.13 89,25.32 86.72,25.32 83.86,22.46 U4.7 | LED1.2 2.55,22.63 3.15,22.03 3.15,21.12 2.55,20.51 LED2.2 | LED2.2 2.55,19.63 3.15,19.03 3.15,18.12 2.55,17.51 LED3.2 2.55,16.63 3.15,16.03 3.15,15.12 2.55,14.51 LED4.2 2.55,13.63 3.15,13.03 3.15,12.12 2.55,11.51 LED5.2 2.55,10.63 3.15,10.03 3.15,9.12 2.55,8.51 LED6.2 2.55,7.63 3.15,7.03 3.15,6.12 | LED7.2 2.55,5.51 3.15,6.12 | 22.18,32 21.9,32 T1.2 17,27.1 17,21.67 17,21.63 16.62,21.25 REG2.4 17.57,19.72 17.76,19.72 18,19.67 | LED2.2 3.05,19.77 3.55,20.27 6.6,20.27 REG1.4 | J8.1 83.66,5.51 88.55,5.51 | C3.2 43.85,37.17 42.91,37.17 | 42.91,37.17 42.17,37.17 41.8,36.81 41.8,36.47 U2.18 | C16.2 48.24,36.75 48.24,36.37 46.91,35.04 U2.12 | U2.63 50.52,27.8 50.91,27.42 51.1,27.42 52.43,28.75 C2.2 52.62,28.94 53.57,29.89 53.57,31.42 54.34,32.18 | 54.34,32.18 54.72,32.56 U3.GND4P 54.34,32.18 | 54.34,32.18 49.76,36.75 48.43,36.75 C16.2
  Top 0.254: U3.GND3P 54.72,43.04 51.29,43.04 SW1.5 | v42.91,37.13 42.91,37.17 | C16.2 48.24,36.94 48.24,37.7 42.91,43.04 SW1.4 | 74.34,32.75 72.62,34.46 72.62,35.23 U3.GND2P | U4.2 76.05,22.46 | J1.1 14.9,6.65 13.95,6.65 13,5.7 3.66,5.7 3.28,6.08 3.15,6.12 | R1.2 30.14,35.04 30.9,34.27 30.9,33.7 C14.2 31.09,33.51 33.19,33.51 34.71,31.99 | 34.71,31.99 34.71,29.7 35.48,28.94 C5.2 | 35.86,33.13 36.24,33.51 C1.2 | 35.86,33.13 34.71,31.99 | 35.86,33.13 37,31.99 37.19,31.99 37.57,31.61 U2.31 | 29.7,37.7 31.09,37.7 31.66,38.27 31.66,40.37 33.57,42.27 34.71,42.27 S1.2 | R10.1 20.04,39.23 20,39.23 | 37.19,17.7 37,17.89 34.9,17.89 34.71,18.08 34.71,21.51 36.05,22.84 41.76,22.84 42.14,23.22 U2.47 | 37.19,17.7 37.38,17.51 37.95,17.51 R14.2 | R31.2 49.57,24.75 49,24.75 45.57,21.32 45,21.32 C4.2 44.81,21.13 44.81,18.58 42.5,16.27 42.04,16.27 39.51,13.74 | U5.5 30.9,20.94 29.19,20.94 R16.2 29,20.94 26,20.94 | v37.19,17.89 37.19,17.7 | 16.81,14.01 C8.2
  Top 0.508: C7.2 9.35,16.02 | 9.35,16.02 8.85,15.52 C17.2 8.85,13.26 8.77,13.18 8.77,11.16 9.9,10.04 20.26,10.04 22.2,11.97 C9.- | C11.2 17.35,16.02 | C8.2 16.85,15.52 17.35,16.02 | REG1.4 9.35,20.32 9.35,16.02 | REG2.4 17.35,20.32 17.35,16.02 | C13.- 22,19.97 | 18,19.67 18.2,19.47 22,19.47 22,19.97 | CN1.1 39.51,13.74 38.59,14.66 29.79,14.66 26,18.45 26,20.94 26,25.21 24.96,26.25 23.04,26.25 22,25.21 22,19.97
  Bottom 0.254: v42.91,37.13 42.91,43.04 SW1.4 | SW1.5 51.1,43.23 50.33,43.23 49.38,44.18 43.86,44.18 42.91,43.23 SW1.4 | U4.2 76.24,22.46 83.67,22.46 U4.7 | J1.1 15.09,6.65 19.09,6.65 20.04,5.7 21.95,5.7 22.9,6.65 J2.1 | J14.2 57.76,6.65 58.91,7.79 67.29,7.79 68.24,6.84 69.38,6.84 J3.1 69.58,6.65 70.53,5.7 80.43,5.7 81.39,6.65 82.34,6.65 J8.1 | v37.19,17.89 37.19,15.99 40.62,12.56 CN1.1 | SW1.4 42.71,43.23 40.24,43.23 39.86,43.61 36.05,43.61 34.9,42.47 S1.2
  Bottom 0.508: CN1.1 48.08,5.17 56.01,5.17 J14.2
  other vias: 5,1.17 15,1.17 25,1.17 35,1.17 45,1.17 55,1.17 65,1.17 75,1.17 85,1.17 80,36.17 85,31.17 75,41.17 5,31.17 10,36.17 29.75,16.67 26,7.17 26,17.17 22,17.17 19,7.17 17,7.17 22,23.17 28,21.17 69,45.17 21,45.17 61,45.17 29,45.17 42,41.17 46,41.17 53,34.17 42,30.17 44,32.17 70,20.17 58,20.17 63,20.17 12,22.67 12,18.67 26,11.17 22,10.17 20,12.67 39,22.17 48,23.17 52,23.17 52,11.17 47,13.17 49,11.17 62,17.17 56,11.17
  pour Bottom: -1,47.17 91,47.17 91,-0.83 -1,-0.83
  pour Top: -1,47.17 91,47.17 91,-0.83 -1,-0.83
LED-L  (via drill 0.3, 0.35)
  Top 0.254: LED1.3 3.05,24.57 3.54,25.06 v4.99,25.06 | U2.50 45.76,23.42 45.38,23.8 45,23.8 43.86,22.65 43.86,21.87 43.95,21.78 43.95,20.57 43.05,19.67 43.05,17.36 42.34,16.65 41.53,16.65 40.05,15.17 30,15.17 27,18.17 v27,20.17
  Bottom 0.254: v27,20.17 22.11,25.06 v4.99,25.06
LED-R  (via drill 0.3)
  Top 0.254: v88.05,23.8 88.43,24.18 88.43,24.56 LED8.3 | v56.05,23.8 v65.67,23.8 | v47.09,26.08 41.57,26.08 39.28,28.37 38.14,28.37 37.76,27.99 U2.34
  Bottom 0.254: v65.67,23.8 v88.05,23.8 | v56.05,23.8 49.38,23.8 v47.09,26.08
LED-TOP  (via drill 0.3)
  Top 0.254: v49.76,34.46 48.43,34.46 48.05,34.08 U2.9 | v68.72,18.27 61.57,18.27 50.14,6.84 J14.5
  Bottom 0.254: v49.76,34.46 51.29,34.46 54.34,31.42 55.29,31.42 68.43,18.27 v68.72,18.27
LED-WHITE  (via drill 0.3)
  Top 0.254: v14.52,40.75 14.52,41.51 LED17.A | v36.62,28.94 37.19,28.37 U2.33
  Bottom 0.254: v14.52,40.75 14.9,40.75 26.71,28.94 v36.62,28.94
LOADCELL-L  (via drill 0.3)
  Top 0.254: v46.71,33.32 47.48,34.08 U2.10 | v46.32,14.71 46.32,13.69 v41.38,8.75
  Bottom 0.254: v46.71,33.32 46.33,33.32 45.38,32.37 45.38,15.65 v46.32,14.71 | v41.38,8.75 39.48,8.75 38.33,9.89 CN1.4
LOADCELL-R  (via drill 0.3)
  Top 0.254: v46.52,32.56 46.14,32.94 46.14,33.51 47.09,34.46 U2.11 | v46.52,16.56 41.19,11.22 39.48,11.22 38.33,12.37 CN1.3
  Bottom 0.254: v46.52,16.56 v46.52,32.56
N$1
  Top 0.254: LED1.1 1.45,22.67 LED2.3
N$2
  Top 0.254: LED2.1 1.45,19.67 LED3.3
N$3
  Top 0.254: LED3.1 1.45,16.67 LED4.3
N$4
  Top 0.254: LED5.3 1.45,13.67 LED4.1
N$5
  Top 0.254: LED6.3 1.45,10.67 LED5.1
N$6
  Top 0.254: LED7.3 1.45,7.67 LED6.1
N$7
  Top 0.254: LED8.1 88.55,21.67 LED9.3
N$8
  Top 0.254: U1.10 28.62,33.7 29.19,33.7 30.9,31.99 C14.1
N$9
  Top 0.254: LED9.1 88.55,18.67 LED10.3
N$10
  Top 0.254: LED10.1 88.55,15.67 LED11.3
N$11
  Top 0.254: LED12.3 87.45,13.67 LED11.1
N$12
  Top 0.254: LED13.3 87.45,10.67 LED12.1
N$13
  Top 0.254: LED14.3 87.45,7.67 LED13.1
N$14
  Top 0.254: X2.A5 27.75,38.05 29,36.8 R1.1
N$15
  Top 0.254: X2.B5 24.75,35.92 R2.1
N$16
  Top 0.254: LED15.C 19,43.17 R3.2
N$17
  Top 0.254: T1.1 12.51,27.15 LS1.2
N$18
  Top 0.254: C1.1 37.6,32.61 37.56,32.57 37.56,32.22 U2.30
N$19  (via drill 0.3)
  Top 0.254: v17.57,39.42 17.57,42.47 LED18.A | v27.66,31.61 28.43,31.61 U1.6
  Bottom 0.254: v17.57,39.42 17.57,38.66 24.62,31.61 v27.66,31.61
N$20
  Top 0.254: LED18.C 16.71,43.46 17.64,43.46 18.45,42.65 18.45,40.22 19,39.66 R10.2
N$27
  Top 0.254: R17.1 38.8,19.12 Q1.1
N$28
  Top 0.254: U5.7 30.91,18.42 R15.2 R16.1
N$32
  Top 0.254: LED17.C 18.5,37.67 R32.2
N$49
  Top 0.254: 24.26,39.97 24.26,39.43 24.1,39.27 X2.B4A9 | LED15.A 17.71,44.46 18.64,44.46 22.53,40.56 23.67,40.56 24.26,39.97 | X2.A4B9 28.64,38.89 28.64,39.31 27.98,39.97 24.26,39.97
NRST  (via drill 0.3)
  Top 0.254: C16.1 49.76,35.42 50.52,34.65 R30.2 50.52,34.46 49.95,33.89 49.19,33.89 48.62,33.32 U2.7 48.43,33.13 48.05,32.75 v48.05,31.99 | v53.57,26.46 55.48,26.46 56.43,27.42 56.43,35.42 55.29,36.56 54.34,36.56 48.05,42.85 48.05,43.8 47.29,44.56 41.38,44.56 39.28,42.47 S1.1
  Bottom 0.254: v53.57,26.46 v48.05,31.99
SCL
  Top 0.254: U2.61 50.58,26.27 50.74,26.27 53,24.01 53,22.17 54.01,21.17 55.32,21.17 57.63,18.86 74.69,18.86 U4.4 76.19,15.48 R13.2
SDA
  Top 0.254: U2.62 53.86,23.71 55.32,23.71 57.85,21.17 74.92,21.17 U4.3 77.91,18.18 77.91,15.57 76.5,14.16 R12.2
SERVO-SIG  (via drill 0.35)
  Top 0.254: U5.6 32.37,19.81 v33,19.17
  Bottom 0.254: v33,19.17 33.19,18.98 CN1.7
SPK  (via drill 0.3)
  Top 0.254: v28.24,29.51 22.24,29.51 19,26.27 18.14,26.27 T1.3 | v36.62,29.7 38.14,29.7 38.84,29 45.7,29 48.43,26.27 U2.58
  Bottom 0.254: v28.24,29.51 36.43,29.51 v36.62,29.7
TOGGLE  (via drill 0.3, 0.35)
  Top 0.254: 39.9,35.57 40.81,34.65 U2.22 | 39.9,35.57 39.67,35.8 R4.2 | v33.57,25.13 33.57,18.27 v32.62,17.32 | v38.5,34.17 39.9,35.57
  Bottom 0.254: v33.57,25.13 37.19,28.75 37.19,32.86 v38.5,34.17 | v32.62,17.32 32.62,13.51 32.05,12.94 32.05,11.22 33.19,10.08 CN1.8
UART1-RX
  Top 0.254: U2.43 40.27,24.17 36.7,24.17 29.37,31.51 29.37,32.4 29.22,32.55 28.73,32.55 U1.8
UART1-TX  (via drill 0.3)
  Top 0.254: U1.9 28.73,33.05 29.26,33.05 30.25,32.06 30.25,31.17 36.77,24.65 40.03,24.65 U2.42 40.62,25.13 41,25.51 v41.38,25.51
  Bottom 0.254: v41.38,25.51 41.38,17.13 51.1,7.41 51.1,6.65 52.05,5.7 55.48,5.7 56.05,6.27 56.05,6.65 56.62,7.22 56.62,23.99 55.67,24.94 54.91,24.94 U3.G20P
UART2-RX  (via drill 0.35)
  Top 0.254: U2.17 42.59,36.26 43.02,35.83 43.02,35.16 v44,34.17
  Bottom 0.254: J8.4 55.2,26.48 54.36,26.48 46.67,34.17 v44,34.17
UART2-TX  (via drill 0.35)
  Top 0.254: v44,35.17 45.22,36.39 U2.16
  Bottom 0.254: J8.3 55.15,29.02 54.36,29.02 48.21,35.17 v44,35.17
UART3-RX  (via drill 0.35)
  Top 0.254: v40,30.17 40,32.6 40.19,32.79 40.19,33.13 U2.25
  Bottom 0.254: v40,30.17 40,26.13 35.73,21.86 CN1.5
UART3-TX  (via drill 0.35)
  Top 0.254: v39,30.17 39,31.49 U2.29
  Bottom 0.254: CN1.6 34.5,11.13 34.5,21.67 39,26.17 v39,30.17
UART4-RX  (via drill 0.35)
  Top 0.254: v45,33.17 45,35.27 U2.15
  Bottom 0.254: J14.4 45,14.18 v45,33.17
UART4-TX  (via drill 0.35)
  Top 0.254: v46,32.17 45.69,32.48 45.69,35.25 U2.14
  Bottom 0.254: J14.3 55,7.17 46,16.17 v46,32.17
UART5-RX  (via drill 0.3)
  Top 0.254: v44.43,22.08 45.76,22.08 47.67,23.99 47.67,24.18 47.29,24.56 U2.54 | v33.95,16.18 40.43,16.18 41.38,17.13 v42.14,17.13 | v33.95,17.32 35.86,17.32 U5.1
  Bottom 0.254: v44.43,22.08 44.43,19.41 v42.14,17.13 | v33.95,17.32 v33.95,16.18
UART5-TX
  Top 0.254: U5.4 36.13,20.92 R17.2 38.14,20.94 41.38,20.94 45.38,24.94 46.33,24.94 46.71,24.56 U2.53
UART6-RX  (via drill 0.35)
  Top 0.254: v37,25.17 37.73,25.17 U2.38
  Bottom 0.254: J1.4 10.01,4.17 24,4.17 31.27,11.44 31.27,19.44 v37,25.17
UART6-TX  (via drill 0.35)
  Top 0.254: v37,26.17 38.02,26.17 U2.37
  Bottom 0.254: J1.3 11.5,5.17 23.5,5.17 25.19,6.86 25.19,14.36 v37,26.17
VDD
  Top 0.254: 27.62,11.75 25.31,9.44 9.76,9.44 7.09,12.1 6.14,12.1 D1.K
  Top 0.508: C17.1 5.92,14.17 | 5.92,14.17 REG1.1 | D1.K 5.95,14.14 5.92,14.17 | REG2.1 13.95,14.14 | 13.95,14.14 D2.K 15.45,10.67 19,10.67 24,15.67 C9.+ | C8.1 13.98,14.17 13.95,14.14 | C9.+ 24.24,16.37 25.18,17.31 25.18,22.63 24,23.81 C13.+ | C9.+ 24,15.37 27.62,11.75 31.2,8.17 39.08,8.17 | CN1.2 39.08,8.17 | 39.08,8.17 42,5.25 42,5.17 58.5,5.17 J14.1